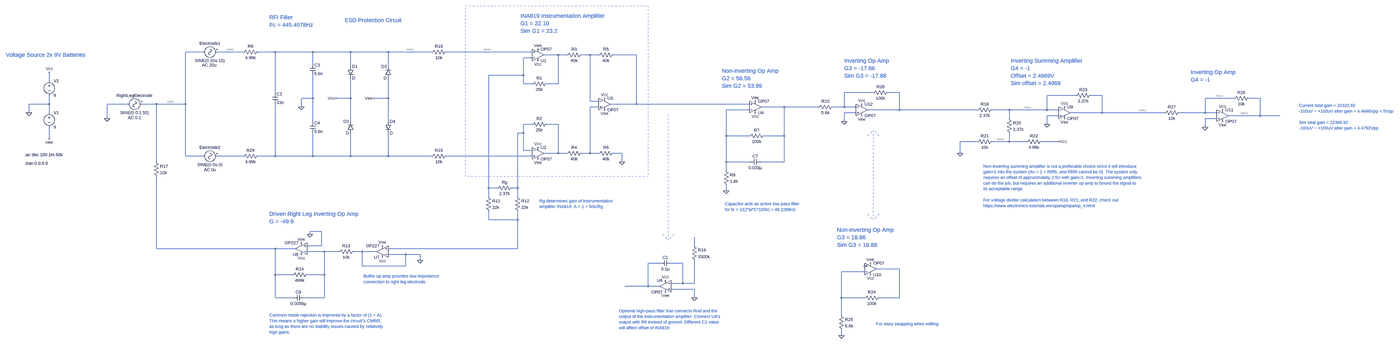
[diagram p0: schematic EEG_Schematic_LT.asc, whole sheet]
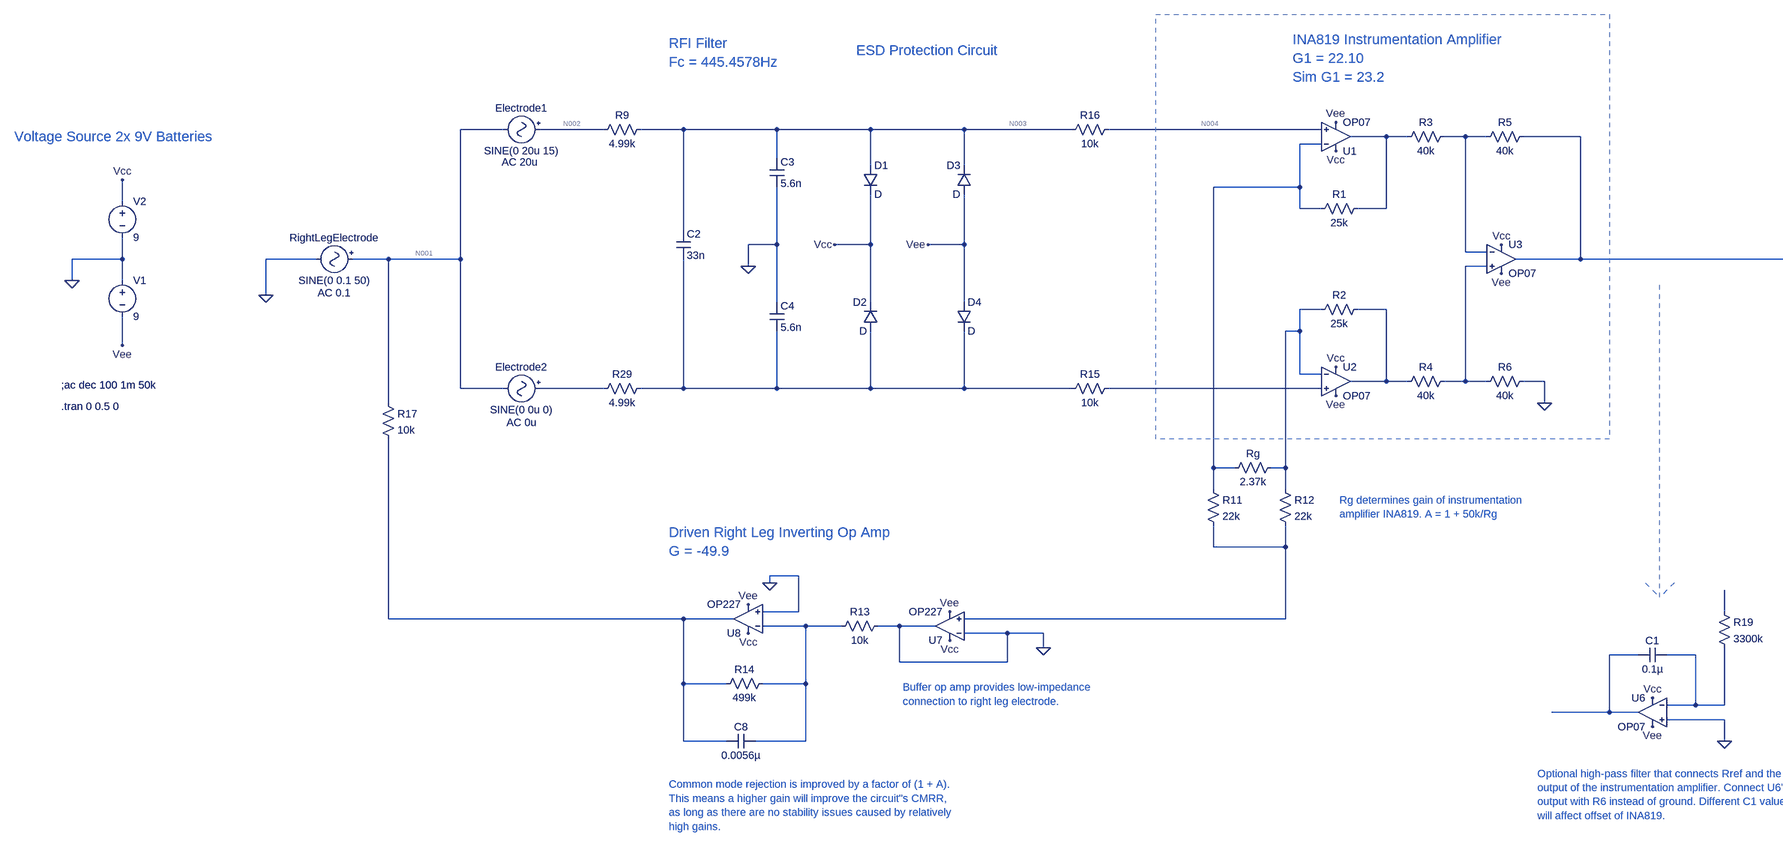
[diagram p1: schematic EEG_Schematic_LT.asc, part, row 1 of 1, column 1 of 2]
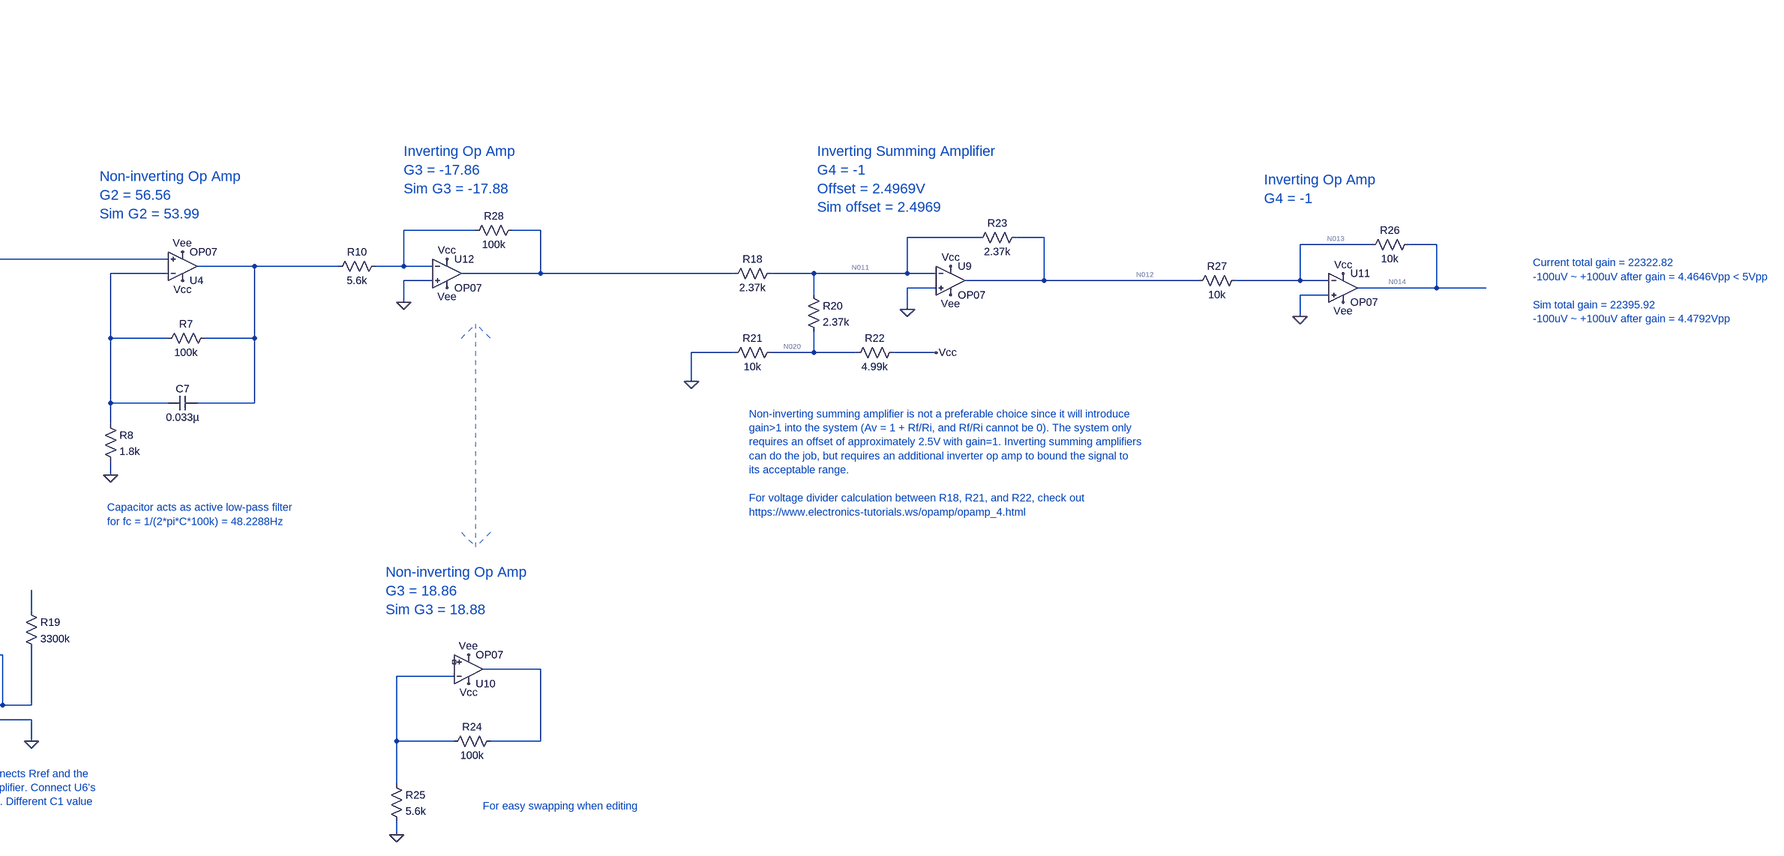
[diagram p2: schematic EEG_Schematic_LT.asc, part, row 1 of 1, column 2 of 2]
EEG_Schematic_LT.asc, the LTspice schematic file:
Version 4
SHEET 1 5588 2080
WIRE -1792 -32 -1888 -32
WIRE -1568 -32 -1712 -32
WIRE -1392 -32 -1488 -32
WIRE -1184 -32 -1392 -32
WIRE -976 -32 -1184 -32
WIRE -768 -32 -976 -32
WIRE -528 -32 -768 -32
WIRE 48 -32 -448 -32
WIRE 192 -16 112 -16
WIRE 240 -16 192 -16
WIRE 368 -16 320 -16
WIRE 416 -16 368 -16
WIRE 624 -16 496 -16
WIRE 48 0 0 0
WIRE -1184 32 -1184 -32
WIRE -976 48 -976 -32
WIRE -768 48 -768 -32
WIRE 0 96 0 0
WIRE 0 96 -192 96
WIRE -2656 128 -2656 80
WIRE 0 144 0 96
WIRE 48 144 0 144
WIRE 192 144 192 -16
WIRE 192 144 128 144
WIRE -1392 192 -1392 -32
WIRE 2160 192 2000 192
WIRE 2304 192 2240 192
WIRE 3376 208 3216 208
WIRE 3520 208 3456 208
WIRE -1184 224 -1184 96
WIRE -1184 224 -1248 224
WIRE -976 224 -976 112
WIRE -976 224 -1056 224
WIRE -768 224 -768 112
WIRE -768 224 -848 224
WIRE 4352 224 4192 224
WIRE 4496 224 4432 224
WIRE 368 240 368 -16
WIRE 416 240 368 240
WIRE -2656 256 -2656 208
WIRE -2656 256 -2768 256
WIRE -2208 256 -2320 256
WIRE -2048 256 -2128 256
WIRE -1888 256 -1888 -32
WIRE -1888 256 -2048 256
WIRE 624 256 624 -16
WIRE 624 256 480 256
WIRE 1248 256 624 256
WIRE -1248 272 -1248 224
WIRE 416 272 368 272
WIRE 1440 272 1312 272
WIRE 1856 272 1440 272
WIRE 2000 272 2000 192
WIRE 2000 272 1936 272
WIRE 2064 272 2000 272
WIRE 1248 288 1120 288
WIRE 2304 288 2304 192
WIRE 2304 288 2128 288
WIRE 2832 288 2304 288
WIRE 3008 288 2912 288
WIRE 3216 288 3216 208
WIRE 3216 288 3008 288
WIRE 3280 288 3216 288
WIRE -2768 304 -2768 256
WIRE -2656 304 -2656 256
WIRE 2064 304 2000 304
WIRE 3520 304 3520 208
WIRE 3520 304 3344 304
WIRE 3968 304 3520 304
WIRE 4192 304 4192 224
WIRE 4192 304 4048 304
WIRE 4256 304 4192 304
WIRE 3280 320 3216 320
WIRE 4496 320 4496 224
WIRE 4496 320 4320 320
WIRE 4656 320 4496 320
WIRE -2320 336 -2320 256
WIRE 3008 336 3008 288
WIRE 4256 336 4192 336
WIRE -1184 352 -1184 224
WIRE -976 352 -976 224
WIRE -768 352 -768 224
WIRE 2000 352 2000 304
WIRE 48 368 0 368
WIRE 192 368 128 368
WIRE 3216 368 3216 320
WIRE 4192 384 4192 336
WIRE 0 416 0 368
WIRE 0 416 -32 416
WIRE 1120 432 1120 288
WIRE 1248 432 1120 432
WIRE 1440 432 1440 272
WIRE 1440 432 1328 432
WIRE -2656 448 -2656 384
WIRE 2832 464 2736 464
WIRE 3008 464 3008 416
WIRE 3008 464 2912 464
WIRE 3104 464 3008 464
WIRE 3280 464 3184 464
WIRE 0 512 0 416
WIRE 48 512 0 512
WIRE 192 528 192 368
WIRE 192 528 112 528
WIRE 240 528 192 528
WIRE 368 528 368 272
WIRE 368 528 320 528
WIRE 416 528 368 528
WIRE 544 528 496 528
WIRE 2736 528 2736 464
WIRE -1888 544 -1888 256
WIRE -1792 544 -1888 544
WIRE -1568 544 -1712 544
WIRE -1392 544 -1392 256
WIRE -1392 544 -1488 544
WIRE -1184 544 -1184 416
WIRE -1184 544 -1392 544
WIRE -976 544 -976 416
WIRE -976 544 -1184 544
WIRE -768 544 -768 416
WIRE -768 544 -976 544
WIRE -528 544 -768 544
WIRE 48 544 -448 544
WIRE -2048 576 -2048 256
WIRE 544 576 544 528
WIRE 1120 576 1120 432
WIRE 1248 576 1120 576
WIRE 1440 576 1440 432
WIRE 1440 576 1312 576
WIRE 1120 624 1120 576
WIRE -192 720 -192 96
WIRE -144 720 -192 720
WIRE -32 720 -32 416
WIRE -32 720 -64 720
WIRE 1120 736 1120 704
WIRE -192 768 -192 720
WIRE -32 768 -32 720
WIRE -192 896 -192 848
WIRE -32 896 -32 848
WIRE -32 896 -192 896
WIRE -1136 960 -1200 960
WIRE -1200 976 -1200 960
WIRE -1136 1040 -1136 960
WIRE -1136 1040 -1216 1040
WIRE 944 1040 944 992
WIRE -2048 1056 -2048 656
WIRE -1392 1056 -2048 1056
WIRE -1280 1056 -1392 1056
WIRE -32 1056 -32 896
WIRE -32 1056 -768 1056
WIRE -1120 1072 -1216 1072
WIRE -1040 1072 -1120 1072
WIRE -912 1072 -960 1072
WIRE -832 1072 -912 1072
WIRE -672 1088 -768 1088
WIRE -592 1088 -672 1088
WIRE -592 1120 -592 1088
WIRE 752 1136 688 1136
WIRE 880 1136 816 1136
WIRE -912 1152 -912 1072
WIRE -672 1152 -672 1088
WIRE -672 1152 -912 1152
WIRE 2304 1168 2176 1168
WIRE 2112 1184 1984 1184
WIRE -1392 1200 -1392 1056
WIRE -1296 1200 -1392 1200
WIRE -1120 1200 -1120 1072
WIRE -1120 1200 -1216 1200
WIRE 880 1248 880 1136
WIRE 880 1248 816 1248
WIRE 944 1248 944 1120
WIRE 944 1248 880 1248
WIRE 688 1264 688 1136
WIRE 688 1264 560 1264
WIRE 752 1264 688 1264
WIRE 944 1280 816 1280
WIRE -1392 1328 -1392 1200
WIRE -1296 1328 -1392 1328
WIRE -1120 1328 -1120 1200
WIRE -1120 1328 -1232 1328
WIRE 944 1328 944 1280
WIRE 1984 1328 1984 1184
WIRE 2112 1328 1984 1328
WIRE 2304 1328 2304 1168
WIRE 2304 1328 2192 1328
WIRE 1984 1424 1984 1328
WIRE 1984 1536 1984 1504
FLAG -2768 304 0
FLAG -2656 80 Vcc
FLAG -2656 448 Vee
FLAG 80 -48 Vee
FLAG 80 16 Vcc
FLAG 448 224 Vcc
FLAG 448 288 Vee
FLAG 80 496 Vcc
FLAG 80 560 Vee
FLAG 1280 304 Vcc
FLAG 1280 240 Vee
FLAG 1120 736 0
FLAG -1200 976 0
FLAG -1248 1088 Vcc
FLAG -1248 1024 Vee
FLAG -2320 336 0
FLAG -800 1104 Vcc
FLAG -800 1040 Vee
FLAG -592 1120 0
FLAG 944 1328 0
FLAG 784 1232 Vcc
FLAG 784 1296 Vee
FLAG 544 576 0
FLAG 2736 528 0
FLAG 3280 464 Vcc
FLAG 3216 368 0
FLAG 2144 1200 Vcc
FLAG 2144 1136 Vee
FLAG 1984 1536 0
FLAG 3312 272 Vcc
FLAG 3312 336 Vee
FLAG 4192 384 0
FLAG 4288 288 Vcc
FLAG 4288 352 Vee
FLAG 2000 352 0
FLAG 2096 256 Vcc
FLAG 2096 320 Vee
FLAG -1248 272 0
FLAG -1056 224 Vcc
FLAG -848 224 Vee
SYMBOL OpAmps\\OP07 80 48 M180
SYMATTR InstName U1
SYMBOL OpAmps\\OP07 80 464 R0
SYMATTR InstName U2
SYMBOL res 144 128 R90
WINDOW 0 0 56 VBottom 2
WINDOW 3 32 56 VTop 2
SYMATTR InstName R1
SYMATTR Value 25k
SYMBOL res 144 352 R90
WINDOW 0 0 56 VBottom 2
WINDOW 3 32 56 VTop 2
SYMATTR InstName R2
SYMATTR Value 25k
SYMBOL res 336 -32 R90
WINDOW 0 0 56 VBottom 2
WINDOW 3 32 56 VTop 2
SYMATTR InstName R3
SYMATTR Value 40k
SYMBOL res 336 512 R90
WINDOW 0 0 56 VBottom 2
WINDOW 3 32 56 VTop 2
SYMATTR InstName R4
SYMATTR Value 40k
SYMBOL OpAmps\\OP07 448 192 R0
SYMATTR InstName U3
SYMBOL res 512 -32 R90
WINDOW 0 0 56 VBottom 2
WINDOW 3 32 56 VTop 2
SYMATTR InstName R5
SYMATTR Value 40k
SYMBOL res 512 512 R90
WINDOW 0 0 56 VBottom 2
WINDOW 3 32 56 VTop 2
SYMATTR InstName R6
SYMATTR Value 40k
SYMBOL res -48 704 R90
WINDOW 0 0 56 VBottom 2
WINDOW 3 32 56 VTop 2
SYMATTR InstName Rg
SYMATTR Value 2.37k
SYMBOL OpAmps\\OP07 1280 336 M180
SYMATTR InstName U4
SYMBOL res 1344 416 R90
WINDOW 0 0 56 VBottom 2
WINDOW 3 32 56 VTop 2
SYMATTR InstName R7
SYMATTR Value 100k
SYMBOL res 1104 608 R0
SYMATTR InstName R8
SYMATTR Value 1.8k
SYMBOL res 1952 256 R90
WINDOW 0 0 56 VBottom 2
WINDOW 3 32 56 VTop 2
SYMATTR InstName R10
SYMATTR Value 5.6k
SYMBOL cap 1312 560 R90
WINDOW 0 0 32 VBottom 2
WINDOW 3 32 32 VTop 2
SYMATTR InstName C7
SYMATTR Value 0.033µ
SYMBOL res -208 752 R0
SYMATTR InstName R11
SYMATTR Value 22k
SYMBOL res -48 752 R0
SYMATTR InstName R12
SYMATTR Value 22k
SYMBOL res -944 1056 R90
WINDOW 0 0 56 VBottom 2
WINDOW 3 32 56 VTop 2
SYMATTR InstName R13
SYMATTR Value 10k
SYMBOL res -1200 1184 R90
WINDOW 0 0 56 VBottom 2
WINDOW 3 32 56 VTop 2
SYMATTR InstName R14
SYMATTR Value 499k
SYMBOL cap -1232 1312 R90
WINDOW 0 0 32 VBottom 2
WINDOW 3 32 32 VTop 2
SYMATTR InstName C8
SYMATTR Value 0.0056µ
SYMBOL Misc\\signal -1696 -32 R90
WINDOW 0 -32 56 VBottom 2
WINDOW 3 32 56 VTop 2
WINDOW 123 88 60 VBottom 2
WINDOW 39 0 0 Left 0
SYMATTR InstName Electrode1
SYMATTR Value SINE(0 20u 15)
SYMATTR Value2 AC 20u
SYMBOL Misc\\signal -1696 544 R90
WINDOW 0 -32 56 VBottom 2
WINDOW 3 32 56 VTop 2
WINDOW 123 60 56 VTop 2
WINDOW 39 0 0 Left 0
SYMATTR InstName Electrode2
SYMATTR Value SINE(0 0u 0)
SYMATTR Value2 AC 0u
SYMBOL Misc\\signal -2112 256 R90
WINDOW 0 -32 56 VBottom 2
WINDOW 3 32 56 VTop 2
WINDOW 123 60 56 VTop 2
WINDOW 39 0 0 Left 0
SYMATTR InstName RightLegElectrode
SYMATTR Value SINE(0 0.1 50)
SYMATTR Value2 AC 0.1
SYMBOL res -432 528 R90
WINDOW 0 0 56 VBottom 2
WINDOW 3 32 56 VTop 2
SYMATTR InstName R15
SYMATTR Value 10k
SYMBOL res -432 -48 R90
WINDOW 0 0 56 VBottom 2
WINDOW 3 32 56 VTop 2
SYMATTR InstName R16
SYMATTR Value 10k
SYMBOL res -2064 560 R0
SYMATTR InstName R17
SYMATTR Value 10k
SYMBOL res 928 1024 R0
SYMATTR InstName R19
SYMATTR Value 3300k
SYMBOL cap 816 1120 R90
WINDOW 0 0 32 VBottom 2
WINDOW 3 32 32 VTop 2
SYMATTR InstName C1
SYMATTR Value 0.1µ
SYMBOL voltage -2656 288 R0
SYMATTR InstName V1
SYMATTR Value 9
SYMBOL voltage -2656 112 R0
SYMATTR InstName V2
SYMATTR Value 9
SYMBOL OpAmps\\OP227 -800 1136 R180
SYMATTR InstName U7
SYMBOL OpAmps\\OP227 -1248 1120 R180
SYMATTR InstName U8
SYMBOL OpAmps\\OP07 784 1200 M0
SYMATTR InstName U6
SYMBOL res 2928 272 R90
WINDOW 0 0 56 VBottom 2
WINDOW 3 32 56 VTop 2
SYMATTR InstName R18
SYMATTR Value 2.37k
SYMBOL res 2992 320 R0
SYMATTR InstName R20
SYMATTR Value 2.37k
SYMBOL res 2928 448 R90
WINDOW 0 0 56 VBottom 2
WINDOW 3 32 56 VTop 2
SYMATTR InstName R21
SYMATTR Value 10k
SYMBOL res 3200 448 R90
WINDOW 0 0 56 VBottom 2
WINDOW 3 32 56 VTop 2
SYMATTR InstName R22
SYMATTR Value 4.99k
SYMBOL OpAmps\\OP07 3312 240 R0
SYMATTR InstName U9
SYMBOL res 3472 192 R90
WINDOW 0 0 56 VBottom 2
WINDOW 3 32 56 VTop 2
SYMATTR InstName R23
SYMATTR Value 2.37k
SYMBOL OpAmps\\OP07 2144 1232 M180
SYMATTR InstName U10
SYMBOL res 2208 1312 R90
WINDOW 0 0 56 VBottom 2
WINDOW 3 32 56 VTop 2
SYMATTR InstName R24
SYMATTR Value 100k
SYMBOL res 1968 1408 R0
SYMATTR InstName R25
SYMATTR Value 5.6k
SYMBOL OpAmps\\OP07 4288 256 R0
SYMATTR InstName U11
SYMBOL res 4448 208 R90
WINDOW 0 0 56 VBottom 2
WINDOW 3 32 56 VTop 2
SYMATTR InstName R26
SYMATTR Value 10k
SYMBOL res 4064 288 R90
WINDOW 0 0 56 VBottom 2
WINDOW 3 32 56 VTop 2
SYMATTR InstName R27
SYMATTR Value 10k
SYMBOL OpAmps\\OP07 2096 224 R0
SYMATTR InstName U12
SYMBOL res 2256 176 R90
WINDOW 0 0 56 VBottom 2
WINDOW 3 32 56 VTop 2
SYMATTR InstName R28
SYMATTR Value 100k
SYMBOL cap -1408 192 R0
SYMATTR InstName C2
SYMATTR Value 33n
SYMBOL cap -1200 32 R0
SYMATTR InstName C3
SYMATTR Value 5.6n
SYMBOL cap -1200 352 R0
SYMATTR InstName C4
SYMATTR Value 5.6n
SYMBOL res -1472 -48 R90
WINDOW 0 0 56 VBottom 2
WINDOW 3 32 56 VTop 2
SYMATTR InstName R9
SYMATTR Value 4.99k
SYMBOL res -1472 528 R90
WINDOW 0 0 56 VBottom 2
WINDOW 3 32 56 VTop 2
SYMATTR InstName R29
SYMATTR Value 4.99k
SYMBOL diode -992 48 R0
SYMATTR InstName D1
SYMBOL diode -960 416 R180
WINDOW 0 24 64 Left 2
WINDOW 3 24 0 Left 2
SYMATTR InstName D2
SYMBOL diode -752 112 R180
WINDOW 0 24 64 Left 2
WINDOW 3 24 0 Left 2
SYMATTR InstName D3
SYMBOL diode -784 352 R0
SYMATTR InstName D4
TEXT -16 -232 Left 3 ;INA819 Instrumentation Amplifier\nG1 = 22.10\nSim G1 = 23.2
TEXT 1096 72 Left 3 ;Non-inverting Op Amp\nG2 = 56.56\nSim G2 = 53.99
TEXT -2896 -16 Left 3 ;Voltage Source 2x 9V Batteries
TEXT 2000 16 Left 3 ;Inverting Op Amp\nG3 = -17.86\nSim G3 = -17.88
TEXT 4760 264 Left 2 ;Current total gain = 22322.82\n-100uV ~ +100uV after gain = 4.4646Vpp < 5Vpp\n \nSim total gain = 22395.92\n-100uV ~ +100uV after gain = 4.4792Vpp
TEXT 1112 808 Left 2 ;Capacitor acts as active low-pass filter \nfor fc = 1/(2*pi*C*100k) = 48.2288Hz
TEXT -1424 1424 Left 2 ;Common mode rejection is improved by a factor of (1 + A). \nThis means a higher gain will improve the circuit"s CMRR, \nas long as there are no stability issues caused by relatively \nhigh gains.
TEXT -1424 864 Left 3 ;Driven Right Leg Inverting Op Amp\nG = -49.9
TEXT -904 1208 Left 2 ;Buffer op amp provides low-impedance\nconnection to right leg electrode.
TEXT -2792 536 Left 2 !;ac dec 100 1m 50k
TEXT -2792 584 Left 2 !.tran 0 0.5 0
TEXT 88 792 Left 2 ;Rg determines gain of instrumentation \namplifier INA819. A = 1 + 50k/Rg
TEXT 528 1400 Left 2 ;Optional high-pass filter that connects Rref and the \noutput of the instrumentation amplifier. Connect U6's\noutput with R6 instead of ground. Different C1 value\nwill affect offset of INA819.
TEXT 3016 16 Left 3 ;Inverting Summing Amplifier\nG4 = -1\nOffset = 2.4969V\nSim offset = 2.4969
TEXT 1960 952 Left 3 ;Non-inverting Op Amp\nG3 = 18.86\nSim G3 = 18.88
TEXT 2864 600 Left 2 ;Non-inverting summing amplifier is not a preferable choice since it will introduce\ngain>1 into the system (Av = 1 + Rf/Ri, and Rf/Ri cannot be 0). The system only \nrequires an offset of approximately 2.5V with gain=1. Inverting summing amplifiers\ncan do the job, but requires an additional inverter op amp to bound the signal to\nits acceptable range.\n \nFor voltage divider calculation between R18, R21, and R22, check out \nhttps://www.electronics-tutorials.ws/opamp/opamp_4.html
TEXT 2176 1472 Left 2 ;For easy swapping when editing
TEXT 4112 80 Left 3 ;Inverting Op Amp\nG4 = -1
TEXT -1424 -224 Left 3 ;RFI Filter\nFc = 445.4578Hz
TEXT -1008 -208 Left 3 ;ESD Protection Circuit
LINE Normal 800 1008 800 304 1
LINE Normal 768 976 800 1008 1
LINE Normal 832 976 800 1008 1
LINE Normal 2128 864 2160 896 1
LINE Normal 2192 864 2160 896 1
LINE Normal 2192 432 2160 400 1
LINE Normal 2128 432 2160 400 1
LINE Normal 2160 896 2160 400 1
RECTANGLE Normal 688 656 -320 -288 1

The netlist it stands for:
* EEG_Schematic_LT.asc
XU1 N004 N008 Vcc Vee N005 LT1001  ; OP07, pins In+ In- V+ V- OUT
XU2 N023 N018 Vcc Vee N019 LT1001  ; OP07, pins In+ In- V+ V- OUT
R1 N005 N008 25k
R2 N019 N018 25k
R3 N006 N005 40k
R4 N015 N019 40k
XU3 N015 N006 Vcc Vee N007 LT1001  ; OP07, pins In+ In- V+ V- OUT
R5 N007 N006 40k
R6 0 N015 40k
Rg N018 N008 2.37k
XU4 N007 N017 Vcc Vee N016 LT1001  ; OP07, pins In+ In- V+ V- OUT
R7 N016 N017 100k
R8 N017 0 1.8k
R10 N009 N016 5.6k
C7 N016 N017 0.033µ
R11 N008 N024 22k
R12 N018 N024 22k
R13 0 N027 10k
R14 N027 N026 499k
C8 N027 N026 0.0056µ
V§Electrode1 N002 N001 SINE(0 20u 15) AC 20u
V§Electrode2 N021 N001 SINE(0 0u 0) AC 0u
V§RightLegElectrode N001 0 SINE(0 0.1 50) AC 0.1
R15 N023 N022 10k
R16 N004 N003 10k
R17 N001 N026 10k
R19 N025 N029 3300k
C1 N029 N028 0.1µ
V1 0 Vee 9
V2 Vcc 0 9
XU7 N024 0 Vcc Vee 0 OP227  ; pins In+ In- V+ V- OUT
XU8 0 N027 Vcc Vee N026 OP227  ; pins In+ In- V+ V- OUT
XU6 0 N029 Vcc Vee N028 LT1001  ; OP07, pins In+ In- V+ V- OUT
R18 N011 N010 2.37k
R20 N011 N020 2.37k
R21 N020 0 10k
R22 Vcc N020 4.99k
XU9 0 N011 Vcc Vee N012 LT1001  ; OP07, pins In+ In- V+ V- OUT
R23 N012 N011 2.37k
XU10 NC_01 N031 Vcc Vee N030 LT1001  ; OP07, pins In+ In- V+ V- OUT
R24 N030 N031 100k
R25 N031 0 5.6k
XU11 0 N013 Vcc Vee N014 LT1001  ; OP07, pins In+ In- V+ V- OUT
R26 N014 N013 10k
R27 N013 N012 10k
XU12 0 N009 Vcc Vee N010 LT1001  ; OP07, pins In+ In- V+ V- OUT
R28 N010 N009 100k
C2 N003 N022 33n
C3 N003 0 5.6n
C4 0 N022 5.6n
R9 N003 N002 4.99k
R29 N022 N021 4.99k
D1 N003 Vcc D
D2 N022 Vcc D
D3 Vee N003 D
D4 Vee N022 D
.model D D
.lib standard.dio
* INA819 Instrumentation Amplifier
* G1 = 22.10
* Sim G1 = 23.2
* Non-inverting Op Amp
* G2 = 56.56
* Sim G2 = 53.99
* Voltage Source 2x 9V Batteries
* Inverting Op Amp
* G3 = -17.86
* Sim G3 = -17.88
* Current total gain = 22322.82
* -100uV ~ +100uV after gain = 4.4646Vpp < 5Vpp
* Sim total gain = 22395.92
* -100uV ~ +100uV after gain = 4.4792Vpp
* Capacitor acts as active low-pass filter
* for fc = 1/(2*pi*C*100k) = 48.2288Hz
* Common mode rejection is improved by a factor of (1 + A).
* This means a higher gain will improve the circuit"s CMRR,
* as long as there are no stability issues caused by relatively
* high gains.
* Driven Right Leg Inverting Op Amp
* G = -49.9
* Buffer op amp provides low-impedance
* connection to right leg electrode.
;ac dec 100 1m 50k
.tran 0 0.5 0
* Rg determines gain of instrumentation
* amplifier INA819. A = 1 + 50k/Rg
* Optional high-pass filter that connects Rref and the
* output of the instrumentation amplifier. Connect U6's
* output with R6 instead of ground. Different C1 value
* will affect offset of INA819.
* Inverting Summing Amplifier
* G4 = -1
* Offset = 2.4969V
* Sim offset = 2.4969
* Non-inverting Op Amp
* G3 = 18.86
* Sim G3 = 18.88
* Non-inverting summing amplifier is not a preferable choice since it will introduce
* gain>1 into the system (Av = 1 + Rf/Ri, and Rf/Ri cannot be 0). The system only
* requires an offset of approximately 2.5V with gain=1. Inverting summing amplifiers
* can do the job, but requires an additional inverter op amp to bound the signal to
* its acceptable range.
* For voltage divider calculation between R18, R21, and R22, check out
* https://www.electronics-tutorials.ws/opamp/opamp_4.html
* For easy swapping when editing
* Inverting Op Amp
* G4 = -1
* RFI Filter
* Fc = 445.4578Hz
* ESD Protection Circuit
.lib LTC.lib
.backanno
.end

* Results of the author's LTspice run, read from the files saved beside the schematic
* Operating Point, zero values left out:
*   V(vcc) = 9 V
*   V(vee) = -9 V
*   V(n011) = 3.404 µV
*   V(n020) = 2.497 V
*   V(n012) = -2.497 V
*   V(n013) = -3.357 µV
*   V(n014) = 2.497 V
*   I(D1) = -9.01 pA
*   I(D2) = -9.01 pA
*   I(D3) = -9.01 pA
*   I(D4) = -9.01 pA
*   I(R18) = 1.436 nA
*   I(R20) = -1.054 mA
*   I(R21) = 249.7 µA
*   I(R22) = 1.303 mA
*   I(R23) = -1.054 mA
*   I(R26) = 249.7 µA
*   I(R27) = 249.7 µA
*   I(V1) = -26.16 mA
*   I(V2) = -26.41 mA
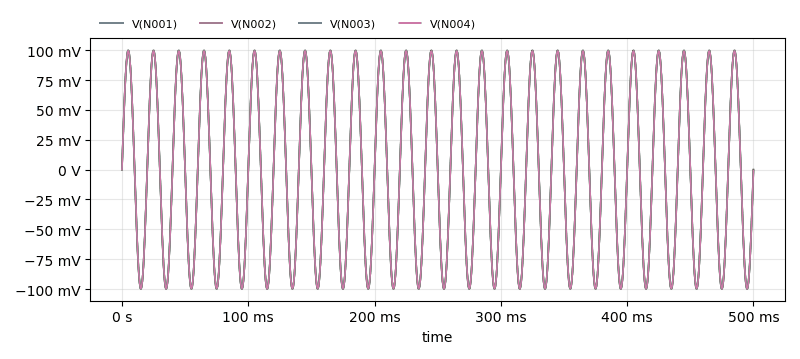
[diagram p3: Transient Analysis of EEG_Schematic_LT.asc, plotted from the saved traces]
* Transient Analysis, 1 run:
*   V(N001): min -99.81 mV, max 99.89 mV, average 59.53 nV, rms 70.71 mV, last 0 V
*   V(N002): min -99.8 mV, max 99.9 mV, average 908.2 nV, rms 70.71 mV, last 0 V
*   V(N003): min -99.4 mV, max 99.55 mV, average 1.143 µV, rms 70.32 mV, last -878.9 µV
*   V(N004): min -99.4 mV, max 99.55 mV, average 1.143 µV, rms 70.32 mV, last -879.2 µV